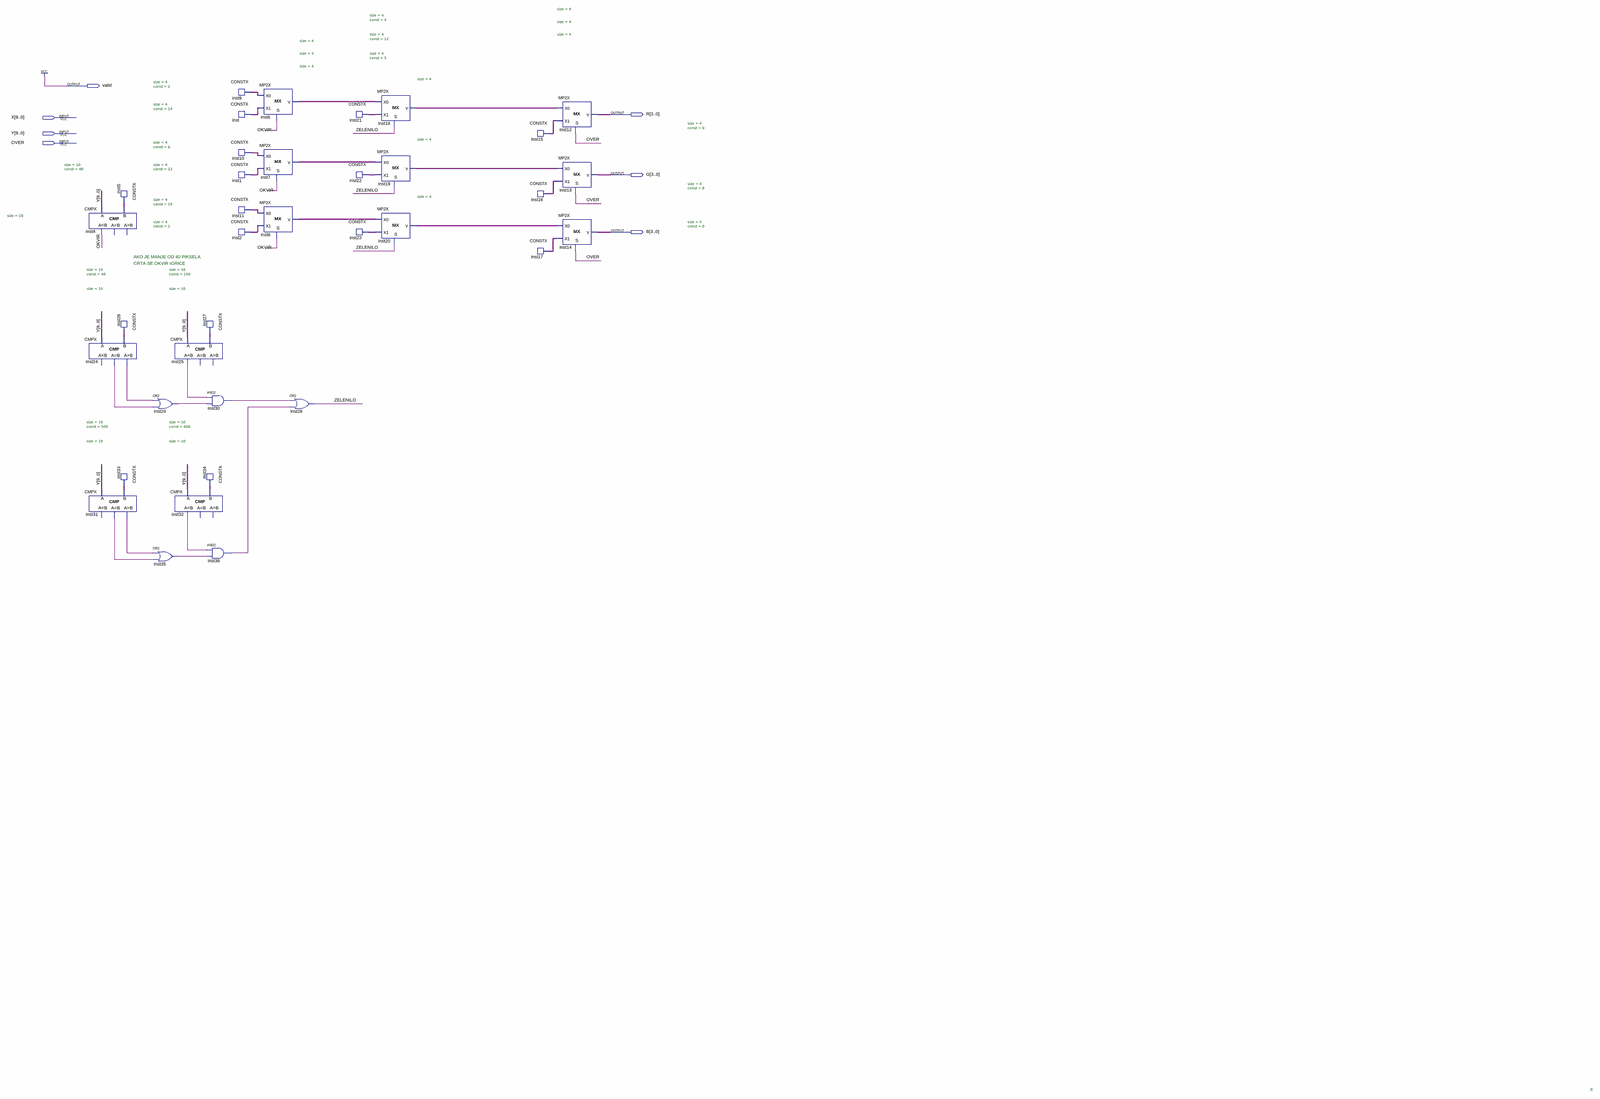
[diagram p0: schematic sheet, whole]
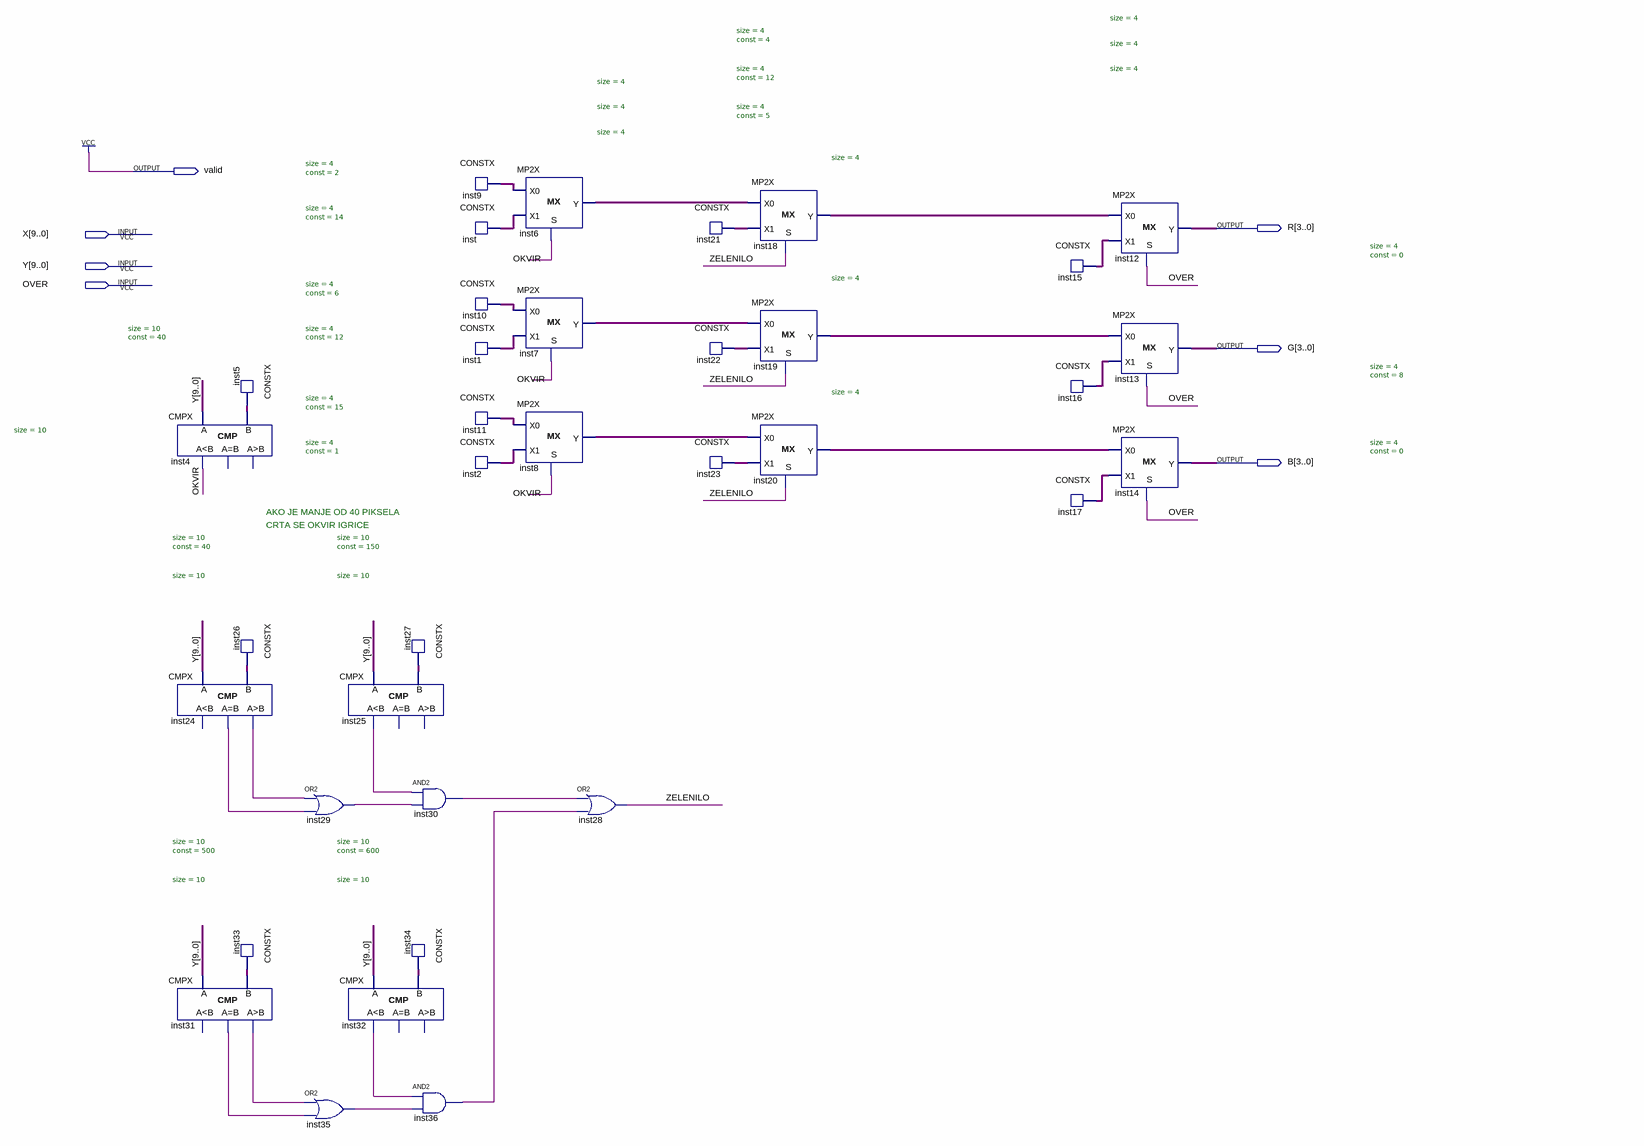
[diagram p1: schematic sheet, upper left part]
// Quartus schematic Layer_Frame.bdf as structural Verilog: 36 symbols, 7 pins
module Layer_Frame (
  input  [9:0] X,
  input  [9:0] Y,
  input  OVER,
  output valid,
  output [3:0] R,
  output [3:0] G,
  output [3:0] B
);

  wire inst24_eq, inst24_gr, inst25_ls, inst29_out, inst30_out, inst31_eq, inst31_gr, inst32_ls, inst35_out,
       inst36_out, OKVIR, ZELENILO;
  wire [3:0] inst1_data, inst2_data, inst6_y, inst7_y, inst8_y, inst9_data, inst10_data, inst11_data,
       inst15_data, inst16_data, inst17_data, inst18_y, inst19_y, inst20_y, inst21_data, inst22_data,
       inst23_data, inst_data;
  wire [9:0] inst5_data, inst26_data, inst27_data, inst33_data, inst34_data;

  CMPX #(.size(10)) inst4 (.A(Y), .B(inst5_data), .ls(OKVIR));  // open: eq, gr
  CMPX #(.size(10)) inst24 (.A(Y), .B(inst26_data), .eq(inst24_eq), .gr(inst24_gr));  // open: ls
  CMPX #(.size(10)) inst31 (.A(Y), .B(inst33_data), .eq(inst31_eq), .gr(inst31_gr));  // open: ls
  CONSTX #(.size(10), .\const (40)) inst5 (.data(inst5_data));
  CONSTX #(.size(10), .\const (40)) inst26 (.data(inst26_data));
  CONSTX #(.size(10), .\const (500)) inst33 (.data(inst33_data));
  CMPX #(.size(10)) inst25 (.A(Y), .B(inst27_data), .ls(inst25_ls));  // open: eq, gr
  or inst29 (inst29_out, inst24_gr, inst24_eq);
  CMPX #(.size(10)) inst32 (.A(Y), .B(inst34_data), .ls(inst32_ls));  // open: eq, gr
  or inst35 (inst35_out, inst31_gr, inst31_eq);
  CONSTX #(.size(10), .\const (150)) inst27 (.data(inst27_data));
  and inst30 (inst30_out, inst25_ls, inst29_out);
  CONSTX #(.size(10), .\const (600)) inst34 (.data(inst34_data));
  and inst36 (inst36_out, inst32_ls, inst35_out);
  CONSTX #(.size(4), .\const (2)) inst9 (.data(inst9_data));
  CONSTX #(.size(4), .\const (14)) inst (.data(inst_data));
  CONSTX #(.size(4), .\const (6)) inst10 (.data(inst10_data));
  CONSTX #(.size(4), .\const (12)) inst1 (.data(inst1_data));
  CONSTX #(.size(4), .\const (15)) inst11 (.data(inst11_data));
  CONSTX #(.size(4), .\const (1)) inst2 (.data(inst2_data));
  MP2X #(.size(4)) inst6 (.S(OKVIR), .X0(inst9_data), .X1(inst_data), .Y(inst6_y));
  MP2X #(.size(4)) inst7 (.S(OKVIR), .X0(inst10_data), .X1(inst1_data), .Y(inst7_y));
  MP2X #(.size(4)) inst8 (.S(OKVIR), .X0(inst11_data), .X1(inst2_data), .Y(inst8_y));
  or inst28 (ZELENILO, inst30_out, inst36_out);
  CONSTX #(.size(4), .\const (4)) inst21 (.data(inst21_data));
  CONSTX #(.size(4), .\const (12)) inst22 (.data(inst22_data));
  CONSTX #(.size(4), .\const (5)) inst23 (.data(inst23_data));
  MP2X #(.size(4)) inst18 (.S(ZELENILO), .X0(inst6_y), .X1(inst21_data), .Y(inst18_y));
  MP2X #(.size(4)) inst19 (.S(ZELENILO), .X0(inst7_y), .X1(inst22_data), .Y(inst19_y));
  MP2X #(.size(4)) inst20 (.S(ZELENILO), .X0(inst8_y), .X1(inst23_data), .Y(inst20_y));
  CONSTX #(.size(4), .\const (0)) inst15 (.data(inst15_data));
  CONSTX #(.size(4), .\const (8)) inst16 (.data(inst16_data));
  CONSTX #(.size(4), .\const (0)) inst17 (.data(inst17_data));
  MP2X #(.size(4)) inst12 (.S(OVER), .X0(inst18_y), .X1(inst15_data), .Y(R));
  MP2X #(.size(4)) inst13 (.S(OVER), .X0(inst19_y), .X1(inst16_data), .Y(G));
  MP2X #(.size(4)) inst14 (.S(OVER), .X0(inst20_y), .X1(inst17_data), .Y(B));

  assign valid = 1'b1;

  // Notes on the sheet:
  //   AKO JE MANJE OD 40 PIKSELA
  //   CRTA SE OKVIR IGRICE
  //   X
endmodule
